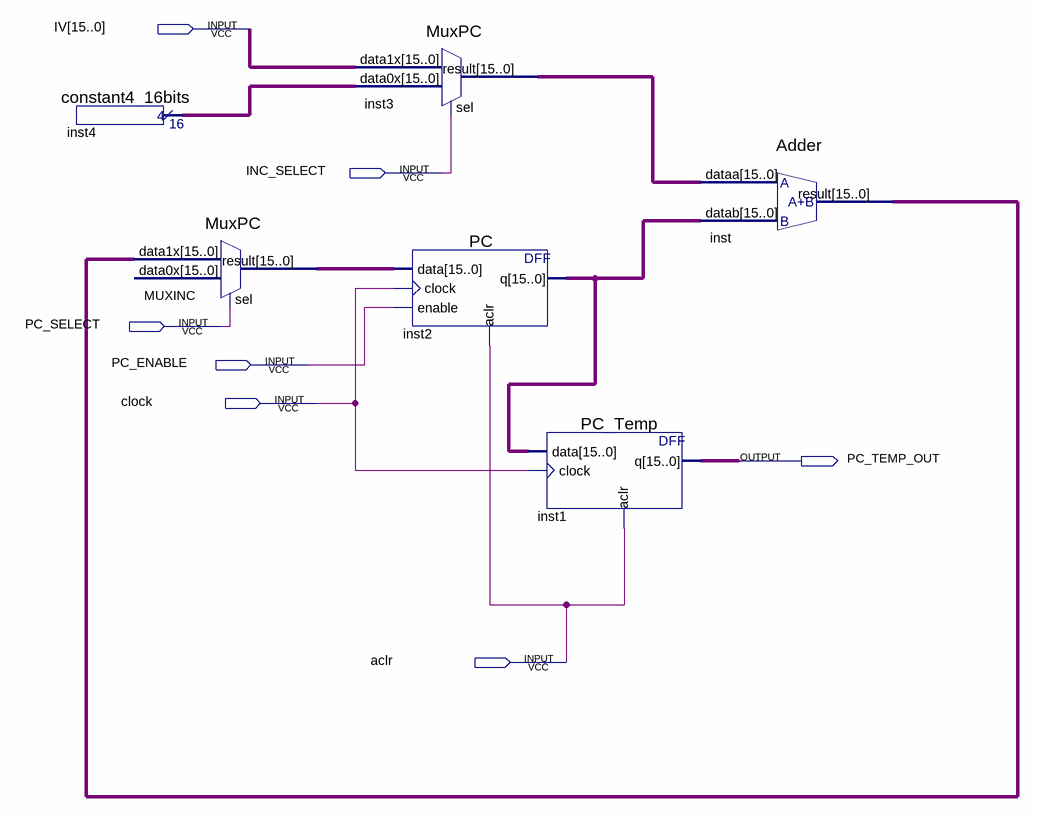
[diagram p0: schematic sheet]
// Quartus schematic InstructionAdressGenerator.bdf as structural Verilog: 6 symbols, 7 pins
module InstructionAdressGenerator (
  input  [15:0] IV,
  input  INC_SELECT,
  input  PC_SELECT,
  input  PC_ENABLE,
  input  clock,
  input  aclr,
  output PC_TEMP_OUT
);

  wire [15:0] inst1_q, inst2_q, inst3_result, inst4_result, inst_result, MUXINC_result;

  constant4_16bits inst4 (.result(inst4_result));
  MuxPC MUXINC (.data1x(inst_result), .sel(PC_SELECT), .result(MUXINC_result));  // open: data0x
  MuxPC inst3 (.data1x(IV), .data0x(inst4_result), .sel(INC_SELECT), .result(inst3_result));
  PC inst2 (.data(MUXINC_result), .clock(clock), .enable(PC_ENABLE), .aclr(aclr), .q(inst2_q));
  PC_Temp inst1 (.data(inst2_q), .clock(clock), .aclr(aclr), .q(inst1_q));
  Adder inst (.dataa(inst3_result), .datab(inst2_q), .result(inst_result));
endmodule
